# EAGLE design M3_80 (EAGLE 6.2)
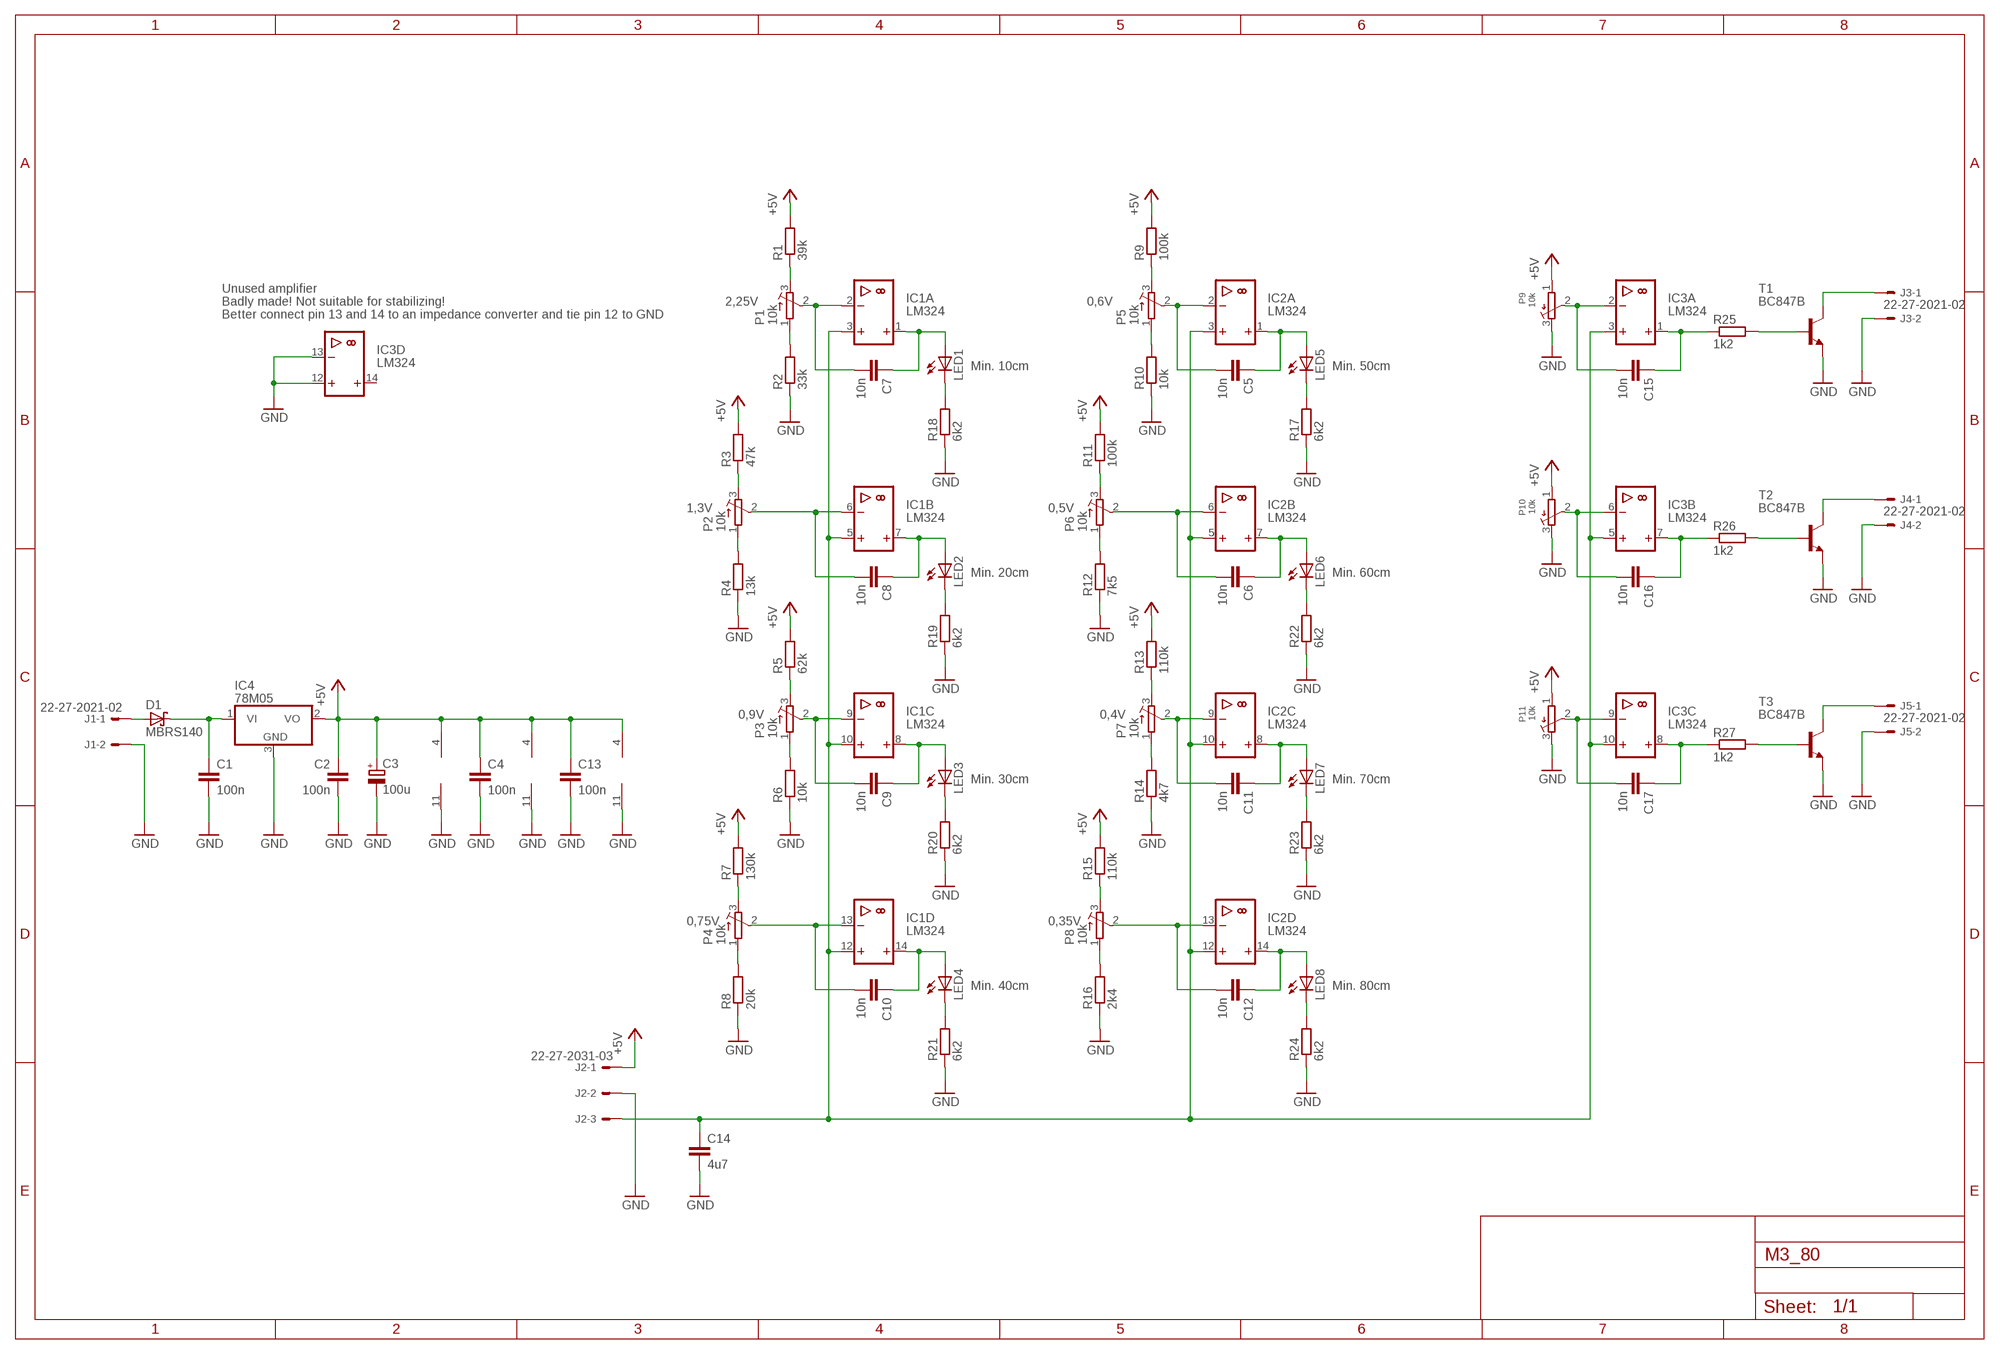
[diagram p0: schematic, sheet 1]

## Parts
C1  100n  C-EUC0805K  [C0805K]
C2  100n  C-EUC0805K  [C0805K]
C3  100u  CPOL-EUD/7343-31W  [D/7343-31W]
C4  100n  C-EUC0805K  [C0805K]
C5  10n  C-EUC0805K  [C0805K]
C6  10n  C-EUC0805K  [C0805K]
C7  10n  C-EUC0805K  [C0805K]
C8  10n  C-EUC0805K  [C0805K]
C9  10n  C-EUC0805K  [C0805K]
C10  10n  C-EUC0805K  [C0805K]
C11  10n  C-EUC0805K  [C0805K]
C12  10n  C-EUC0805K  [C0805K]
C13  100n  C-EUC0805K  [C0805K]
C14  4u7  C-EUC0805K  [C0805K]
C15  10n  C-EUC0805K  [C0805K]
C16  10n  C-EUC0805K  [C0805K]
C17  10n  C-EUC0805K  [C0805K]
D1  MBRS140  MBRS130LT3  [SMB]
IC1  LM324  QUAD-OPAMPD  [SO14]
IC2  LM324  QUAD-OPAMPD  [SO14]
IC3  LM324  QUAD-OPAMPD  [SO14]
IC4  78M05  7805DT  [TO252]
J1  22-27-2021-02  [6410-02]
J2  22-27-2031-03  [6410-03]
J3  22-27-2021-02  [6410-02]
J4  22-27-2021-02  [6410-02]
J5  22-27-2021-02  [6410-02]
LED1  LED3MM  [LED3MM]
LED2  LED3MM  [LED3MM]
LED3  LED3MM  [LED3MM]
LED4  LED3MM  [LED3MM]
LED5  LED3MM  [LED3MM]
LED6  LED3MM  [LED3MM]
LED7  LED3MM  [LED3MM]
LED8  LED3MM  [LED3MM]
P1  10k  EVM1D  [EVM1D]
P2  10k  EVM1D  [EVM1D]
P3  10k  EVM1D  [EVM1D]
P4  10k  EVM1D  [EVM1D]
P5  10k  EVM1D  [EVM1D]
P6  10k  EVM1D  [EVM1D]
P7  10k  EVM1D  [EVM1D]
P8  10k  EVM1D  [EVM1D]
P9  10k  T63YA  [T63YA]
P10  10k  T63YA  [T63YA]
P11  10k  T63YA  [T63YA]
R1  39k  R-EU_M0805  [M0805]
R2  33k  R-EU_M0805  [M0805]
R3  47k  R-EU_M0805  [M0805]
R4  13k  R-EU_M0805  [M0805]
R5  62k  R-EU_M0805  [M0805]
R6  10k  R-EU_M0805  [M0805]
R7  130k  R-EU_M0805  [M0805]
R8  20k  R-EU_M0805  [M0805]
R9  100k  R-EU_M0805  [M0805]
R10  10k  R-EU_M0805  [M0805]
R11  100k  R-EU_M0805  [M0805]
R12  7k5  R-EU_M0805  [M0805]
R13  110k  R-EU_M0805  [M0805]
R14  4k7  R-EU_M0805  [M0805]
R15  110k  R-EU_M0805  [M0805]
R16  2k4  R-EU_M0805  [M0805]
R17  6k2  R-EU_M0805  [M0805]
R18  6k2  R-EU_M0805  [M0805]
R19  6k2  R-EU_M0805  [M0805]
R20  6k2  R-EU_M0805  [M0805]
R21  6k2  R-EU_M0805  [M0805]
R22  6k2  R-EU_M0805  [M0805]
R23  6k2  R-EU_M0805  [M0805]
R24  6k2  R-EU_M0805  [M0805]
R25  1k2  R-EU_M0805  [M0805]
R26  1k2  R-EU_M0805  [M0805]
R27  1k2  R-EU_M0805  [M0805]
T1  BC847B  BC847  [SOT23]
T2  BC847B  BC847  [SOT23]
T3  BC847B  BC847  [SOT23]

## Nets
+5V: C2.1 C3.+ C4.1 C13.1 IC1.4(P:V+) IC2.4(P:V+) IC3.4(P:V+) IC4.2(VO) J2.1 P9.1 P10.1 P11.1 R1.2 R3.2 R5.2 R7.2 R9.2 R11.2 R13.2 R15.2
GND: C1.2 C2.2 C3.- C4.2 C13.2 C14.2 IC1.11(P:V-) IC2.11(P:V-) IC3.11(P:V-) IC3.12(D:+IN) IC3.13(D:-IN) IC4.3(GND) J1.2 J2.2 J3.2 J4.2 J5.2 P9.3 P10.3 P11.3 R2.1 R4.1 R6.1 R8.1 R10.1 R12.1 R14.1 R16.1 R17.1 R18.1 R19.1 R20.1 R21.1 R22.1 R23.1 R24.1 T1.2(E) T2.2(E) T3.2(E)
N$1: C1.1 D1.C IC4.1(VI)
N$2: C7.2 IC1.2(A:-IN) P1.2
N$3: C8.2 IC1.6(B:-IN) P2.2
N$4: C9.2 IC1.9(C:-IN) P3.2
N$5: C10.2 IC1.13(D:-IN) P4.2
N$6: C5.2 IC2.2(A:-IN) P5.2
N$7: C6.2 IC2.6(B:-IN) P6.2
N$8: C11.2 IC2.9(C:-IN) P7.2
N$9: C12.2 IC2.13(D:-IN) P8.2
N$10: C5.1 IC2.1(A:OUT) LED5.A
N$11: LED5.K(C) R17.2
N$12: C8.1 IC1.7(B:OUT) LED2.A
N$13: LED2.K(C) R19.2
N$14: C7.1 IC1.1(A:OUT) LED1.A
N$15: LED1.K(C) R18.2
N$16: C9.1 IC1.8(C:OUT) LED3.A
N$17: LED3.K(C) R20.2
N$18: C10.1 IC1.14(D:OUT) LED4.A
N$19: LED4.K(C) R21.2
N$20: C6.1 IC2.7(B:OUT) LED6.A
N$21: LED6.K(C) R22.2
N$22: C11.1 IC2.8(C:OUT) LED7.A
N$23: LED7.K(C) R23.2
N$24: C12.1 IC2.14(D:OUT) LED8.A
N$25: LED8.K(C) R24.2
N$26: P5.3 R9.1
N$27: P5.1 R10.2
N$28: P6.3 R11.1
N$29: P6.1 R12.2
N$30: P7.3 R13.1
N$31: P7.1 R14.2
N$32: P8.3 R15.1
N$33: P1.3 R1.1
N$34: P8.1 R16.2
N$35: C16.2 IC3.6(B:-IN) P10.2
N$36: C15.2 IC3.2(A:-IN) P9.2
N$37: C17.2 IC3.9(C:-IN) P11.2
N$38: P1.1 R2.2
N$39: D1.A J1.1
N$41: P2.3 R3.1
N$42: P2.1 R4.2
N$43: P3.3 R5.1
N$44: P3.1 R6.2
N$45: P4.3 R7.1
N$46: P4.1 R8.2
N$47: C15.1 IC3.1(A:OUT) R25.1
N$48: R25.2 T1.1(B)
N$49: C16.1 IC3.7(B:OUT) R26.1
N$50: R26.2 T2.1(B)
N$51: C17.1 IC3.8(C:OUT) R27.1
N$52: R27.2 T3.1(B)
N$53: J5.1 T3.3(C)
N$54: J4.1 T2.3(C)
N$55: J3.1 T1.3(C)
N$71: C14.1 IC1.3(A:+IN) IC1.5(B:+IN) IC1.10(C:+IN) IC1.12(D:+IN) IC2.3(A:+IN) IC2.5(B:+IN) IC2.10(C:+IN) IC2.12(D:+IN) IC3.3(A:+IN) IC3.5(B:+IN) IC3.10(C:+IN) J2.3
Unconnected: IC3.14(D:OUT)

## Notes on the sheet
- Unused amplifier
- Badly made! Not suitable for stabilizing! | 2,25V | 0,6V
- Better connect pin 13 and 14 to an impedance converter and tie pin 12 to GND
- Min. 10cm | Min. 50cm
- 1,3V | 0,5V
- Min. 20cm | Min. 60cm
- 0,9V | 0,4V
- Min. 30cm | Min. 70cm
- 0,75V | 0,35V
- Min. 40cm | Min. 80cm

## Library data of the parts
C1 C2 C4-C17 = resistor:C-EU: CAPACITOR, European symbol
C3 = resistor:CPOL-EU: POLARIZED CAPACITOR, European symbol
D1 = diode:MBRS130LT3: Schottky Power Rectifier Source: http://www.onsemi.com/pub/Collateral/MBRS130LT3-D.PDF
IC1-IC3 = OPAMP:QUAD-OPAMP
IC4 = linear:78*: Positive VOLTAGE REGULATOR Source: http://cache.national.com/ds/LM/LM78L05.pdf http://www.fairchildsemi.com/ds/LM/LM7805.pdf
J1 J3-J5 = con-molex:22-?-02: CONNECTOR wire to board 2.54 mm (.1 inch) pitch header; OC_FARNELL: unknown; OC_NEWARK: unknown
J2 = con-molex:22-?-03: CONNECTOR wire to board 2.54 mm (.1 inch) pitch header; OC_FARNELL: unknown; OC_NEWARK: unknown
LED1-LED8 = led:LED: LED OSRAM: - CHIPLED LG R971, LG N971, LY N971, LG Q971, LY Q971, LO R971, LY R971 LH N974, LH R974 LS Q976, LO Q976, LY Q976 LO Q996 - Hyper CHIPLED LW Q18S LB Q993, LB Q99A, LB R99A - SideLED LS A670, LO A670, LY A670, LG A670, LP A670 LB A673, LV A673, LT A673, LW A673 LH A674 LY A675 LS A676, LA A676, LO A676, LY A676, LW A676 LS A679, LY A679, LG A679 - Hyper Micro SIDELED® LS Y876, LA Y876, LO Y876, LY Y876 LT Y87S - SmartLED LW L88C, LW L88S LB L89C, LB L89S, LG L890 LS L89K, LO L89K, LY L89K LS L896, LA L896, LO L896, LY L896 - TOPLED LS T670, LO T670, LY T670, LG T670, LP T670 LSG T670, LSP T670, LSY T670, LOP T670, LYG T670 LG T671, LOG T671, LSG T671 LB T673, LV T673, LT T673, LW T673 LH T674 LS T676, LA T676, LO T676, LY T676, LB T676, LH T676, LSB T676, LW T676 LB T67C, LV T67C, LT T67C, LS T67K, LO T67K, LY T67K, LW E67C LS E67B, LA E67B, LO E67B, LY E67B, LB E67C, LV E67C, LT E67C LW T67C LS T679, LY T679, LG T679 LS T770, LO T770, LY T770, LG T770, LP T770 LB T773, LV T773, LT T773, LW T773 LH T774 LS E675, LA E675, LY E675, LS T675 LS T776, LA T776, LO T776, LY T776, LB T776 LHGB T686 LT T68C, LB T68C - Hyper Mini TOPLED® LB M676 - Mini TOPLED Santana® LG M470 LS M47K, LO M47K, LY M47K Source: http://www.osram.convergy.de LUXEON: - LUMILED® LXK2-PW12-R00, LXK2-PW12-S00, LXK2-PW14-U00, LXK2-PW14-V00 LXK2-PM12-R00, LXK2-PM12-S00, LXK2-PM14-U00 LXK2-PE12-Q00, LXK2-PE12-R00, LXK2-PE12-S00, LXK2-PE14-T00, LXK2-PE14-U00 LXK2-PB12-K00, LXK2-PB12-L00, LXK2-PB12-M00, LXK2-PB14-N00, LXK2-PB14-P00, LXK2-PB14-Q00 LXK2-PR12-L00, LXK2-PR12-M00, LXK2-PR14-Q00, LXK2-PR14-R00 LXK2-PD12-Q00, LXK2-PD12-R00, LXK2-PD12-S00 LXK2-PH12-R00, LXK2-PH12-S00 LXK2-PL12-P00, LXK2-PL12-Q00, LXK2-PL12-R00 Source: www.luxeon.com KINGBRIGHT: KA-3528ASYC Source: www.kingbright.com
P1-P8 = R-Trim_Panasonic:EVM1D
P9-P11 = T63YA Vishay:T63YA
R1-R27 = resistor:R-EU_: RESISTOR, European symbol
T1-T3 = transistor:BC847: NPN TRANSISTOR

## Board
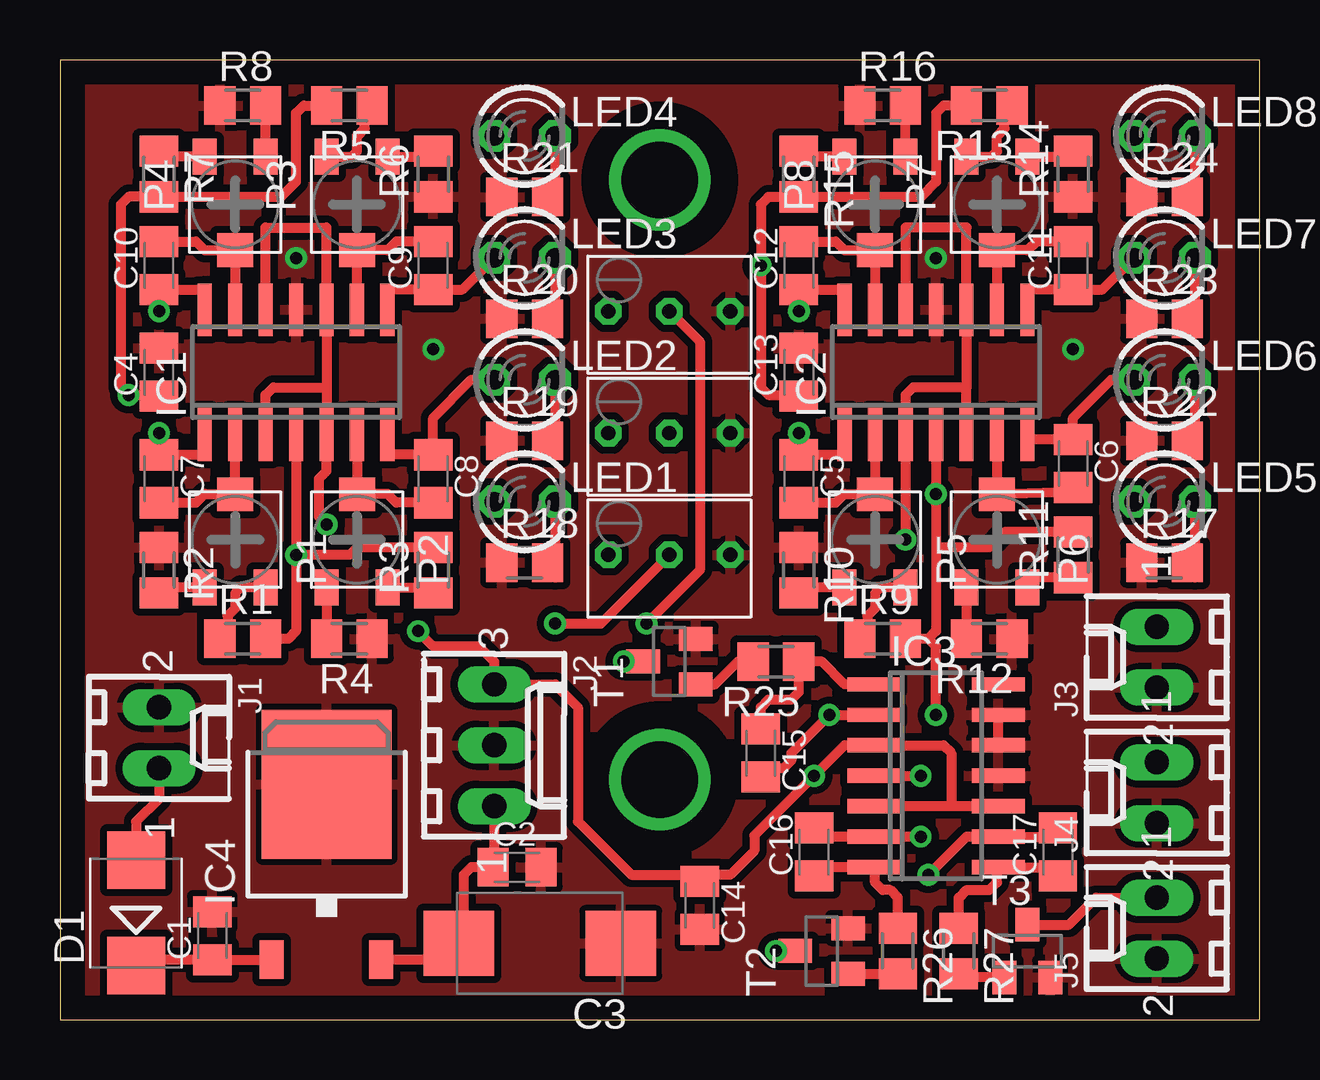
[diagram p1: board, top side]
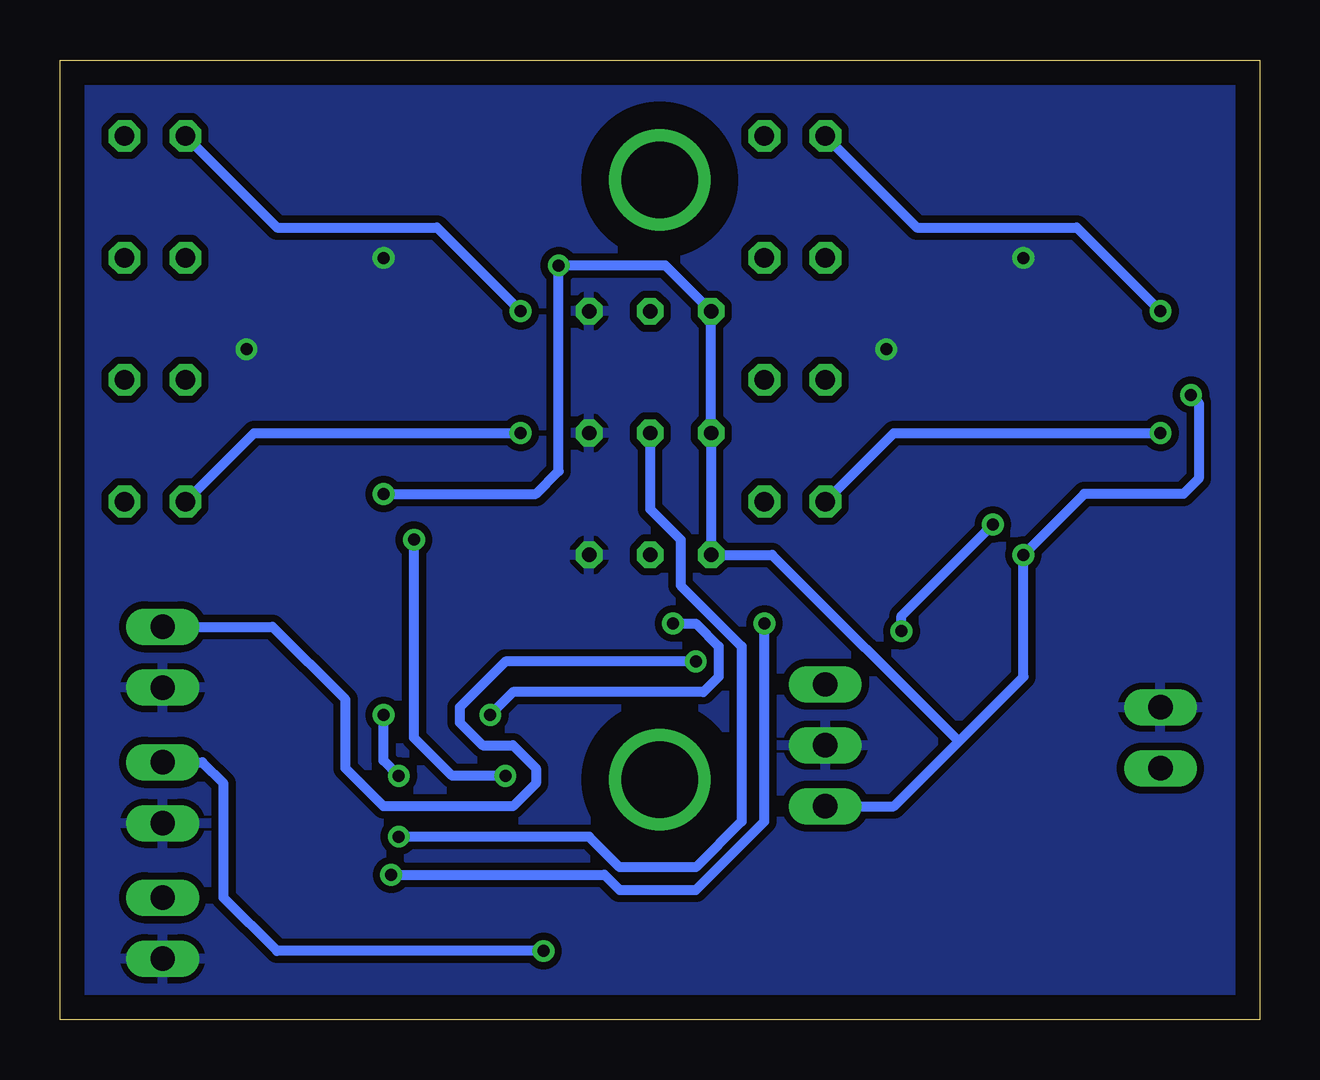
[diagram p2: board, bottom side, seen from below]

Size 50 x 40 mm. Coordinates in mm from the lower left corner, seen from the top.
Outline: 0,0 50,0 50,40 0,40 0,0
Copper layers (1*16): Top 0.035mm / dielectric 1.5mm / Bottom 0.035mm
Design rules: minimum track width 10mil, minimum drill 24mil, track to track 8mil, track to pad 8mil, pad to pad 8mil, via to via 8mil, smd to smd 8mil, copper to edge 40mil, drill to drill 8mil, minimum pad ring 10mil, minimum via ring 8mil, stop-mask expansion 4mil, vias tented up to drill 0mil, thermal gap 10mil
tRestrict: area 22.2,32.2 to 27.8,37.8; area 22.2,7.2 to 27.8,12.8
bRestrict: area 22.2,32.2 to 27.8,37.8; area 22.2,7.2 to 27.8,12.8

### Footprints (pad centres in the part's own frame; a part is rotated, then mirrored left to right if it is on the bottom)
C0805K = smd 1.3 x 1.6: 1 -1,0; 2 1,0
D/7343-31W = smd 2.95 x 2.7: + 3.375,0; - -3.375,0
SMB = smd 2.4 x 2.4: A 2.2,0; C -2.2,0
SO14 = smd 0.6 x 2.2: 1 -3.81,-2.6; 2 -2.54,-2.6; 3 -1.27,-2.6; 4 0,-2.6; 5 1.27,-2.6; 6 2.54,-2.6; 7 3.81,-2.6; 8 3.81,2.6; 9 2.54,2.6; 10 1.27,2.6; 11 0,2.6; 12 -1.27,2.6; 13 -2.54,2.6; 14 -3.81,2.6
TO252 = smd 1 x 1.6: 1 -2.28,-4.8; 2 2.28,-4.8 | smd 5.4 x 6.2: 3 0,2.5
6410-02 = drill 1.016 long: 1 1.27,0; 2 -1.27,0
6410-03 = drill 1.016 long: 1 2.54,0; 2 0,0; 3 -2.54,0
LED3MM = drill 0.813 octagon: A -1.27,0; K 1.27,0
EVM1D = smd 1 x 1.5: 1 -1.275,-2; 3 1.275,-2 | smd 1.5 x 1.4: 2 0,1.9
T63YA = drill 0.6 octagon: 1 0,2.54; 2 0,0; 3 0,-2.54
M0805 = smd 1.3 x 1.6: 1 -0.95,0; 2 0.95,0
SOT23 = smd 1 x 1.4: 1 -0.95,-1.1; 2 0.95,-1.1; 3 0,1.1

### Placement (x,y rotation side)
C1  6.35,3.49 90 top
C2  19.05,6.35 0 top
C3  20,3.17 180 top
C4  4.13,26.99 90 top
C5  30.8,22.54 270 top
C6  42.23,23.18 270 top
C7  4.13,22.54 270 top
C8  15.56,22.54 270 top
C9  15.56,31.43 90 top
C10  4.13,31.43 90 top
C11  42.23,31.43 90 top
C12  30.8,31.43 90 top
C13  30.8,26.99 90 top
C14  26.67,4.76 270 top
C15  29.21,11.11 270 top
C16  31.43,6.99 90 top
C17  41.59,6.99 90 top
D1  3.17,4.45 90 top
IC1  9.84,26.99 0 top
IC2  36.51,26.99 0 top
IC3  36.51,10.16 270 top
IC4  11.11,7.3 0 top
J1  4.13,11.75 270 top
J2  18.1,11.43 270 top
J3  45.72,15.11 90 top
J4  45.72,9.46 90 top
J5  45.72,3.81 90 top
LED1  19.37,21.59 0 top
LED2  19.37,26.67 0 top
LED3  19.37,31.75 0 top
LED4  19.37,36.83 0 top
LED5  46.04,21.59 0 top
LED6  46.04,26.67 0 top
LED7  46.04,31.75 0 top
LED8  46.04,36.83 0 top
P1  7.3,20 0 top
P2  12.38,20 0 top
P3  12.38,33.97 180 top
P4  7.3,33.97 180 top
P5  33.97,20 0 top
P6  39.05,20 0 top
P7  39.05,33.97 180 top
P8  33.97,33.97 180 top
P9  25.4,29.53 90 top
P10  25.4,24.45 90 top
P11  25.4,19.37 90 top
R1  7.62,15.88 0 top
R2  4.13,18.73 270 top
R3  15.56,18.73 90 top
R4  12.06,15.88 180 top
R5  12.06,38.1 180 top
R6  15.56,35.24 90 top
R7  4.13,35.24 270 top
R8  7.62,38.1 0 top
R9  34.29,15.88 0 top
R10  30.8,18.73 270 top
R11  42.23,19.37 90 top
R12  38.73,15.88 180 top
R13  38.73,38.1 180 top
R14  42.23,35.24 90 top
R15  30.8,35.24 270 top
R16  34.29,38.1 0 top
R17  46.04,19.05 0 top
R18  19.37,19.05 0 top
R19  19.37,24.13 0 top
R20  19.37,29.21 0 top
R21  19.37,34.29 0 top
R22  46.04,24.13 0 top
R23  46.04,29.21 0 top
R24  46.04,34.29 0 top
R25  29.84,14.92 180 top
R26  34.92,2.86 270 top
R27  37.47,2.86 270 top
T1  25.4,14.92 90 top
T2  31.75,2.86 90 top
T3  40.32,2.86 0 top

### Tracks (layer width: path | path; a pad name or v marks a point on that pad's centre or on a via)
+5V  (via drill 0.5)
  Top 0.406: IC1.4 v9.84,19.37 | v9.84,19.37 9.84,16.19 9.53,15.88 R1.2 | R3.2 12.38,19.68 12.06,19.37 v9.84,19.37 | R5.2 10.16,38.1 9.84,37.78 9.84,34.92 9.21,34.29 R7.2 2.86,34.29 2.54,33.97 2.54,26.35 v2.86,26.04 4.08,26.04 C4.1 | IC4.2 15.96,2.5 C3.+ 16.83,3.38 16.83,6.03 17.14,6.35 C2.1 18.1,6.4 J2.1 | R13.2 36.83,38.1 36.51,37.78 36.51,34.92 35.88,34.29 R15.2 | R15.2 | 36.51,19.68 v36.51,21.91 IC2.4 | 36.51,19.68 36.51,16.19 36.2,15.88 | 36.2,15.88 R9.2 | R11.2 39.37,20.32 38.73,19.68 36.52,19.68 36.51,19.68 | R15.2 29.53,34.29 29.21,33.97 v29.21,31.43 29.21,26.35 29.53,26.04 30.75,26.04 C13.1 | IC3.4 v35.88,10.16 | v36.51,12.7 36.51,15.56 36.2,15.88
  Bottom 0.406: v2.86,26.04 2.54,25.72 2.54,22.54 3.17,21.91 7.3,21.91 v9.84,19.37 9.84,14.29 12.54,11.59 | J2.1 15.24,8.89 12.54,11.59 | v36.51,21.91 30.16,21.91 29.21,22.86 v29.21,31.43 24.77,31.43 P9.1 P10.1 P11.1 20.32,19.37 12.54,11.59 | v35.88,10.16 36.51,10.79 v36.51,12.7
GND  (via drill 0.5)
  Top 0.406: IC3.12 IC3.13
  other vias: 9.84,31.75 36.51,31.75 42.23,27.94 15.56,27.94
  pour Top (isolate 0.305): 0,0 0,40 50,40 50,0
  pour Bottom (isolate 0.305): 0,0 0,40 50,40 50,0
N$1
  Top 0.406: IC4.1 C1.1 3.42,2.49 D1.C
N$2
  Top 0.406: IC1.2 P1.2 7.21,21.91 6.03,21.91 5.67,21.54 C7.2
N$3
  Top 0.406: IC1.6 P2.2 12.48,21.91 13.65,21.91 14.02,21.54 C8.2
N$4
  Top 0.406: IC1.9 P3.2 12.48,32.07 13.65,32.07 14.02,32.43 C9.2
N$5
  Top 0.406: IC1.13 P4.2 7.21,32.07 6.03,32.07 5.67,32.43 C10.2
N$6
  Top 0.406: IC2.2 P5.2 33.88,21.91 32.7,21.91 32.34,21.54 C5.2
N$7
  Top 0.406: IC2.6 P6.2 42.23,22 C6.2
N$8
  Top 0.406: IC2.9 P7.2 39.15,32.07 40.32,32.07 40.69,32.43 C11.2
N$9
  Top 0.406: IC2.13 P8.2 33.88,32.07 32.7,32.07 32.34,32.43 C12.2
N$10  (via drill 0.5)
  Top 0.406: IC2.1 32.7,23.5 32.66,23.54 C5.1 v30.8,24.45
  Bottom 0.406: LED5.A 41.91,24.45 v30.8,24.45
N$11
  Top 0.406: LED5.K 47.31,18.42 R17.2
N$12
  Top 0.406: IC1.7 13.65,23.5 13.7,23.54 C8.1 15.56,25.08 17.14,26.67 LED2.A
N$13
  Top 0.406: LED2.K 20.64,23.5 R19.2
N$14  (via drill 0.5)
  Top 0.406: IC1.1 6.03,23.5 5.99,23.54 C7.1 v4.13,24.45
  Bottom 0.406: LED1.A 15.24,24.45 v4.13,24.45
N$15
  Top 0.406: LED1.K 20.64,18.42 R18.2
N$16
  Top 0.406: IC1.8 13.65,30.48 13.7,30.43 C9.1 16.78,30.43 LED3.A
N$17
  Top 0.406: LED3.K 20.64,28.58 R20.2
N$18  (via drill 0.5)
  Top 0.406: IC1.14 6.03,30.48 5.99,30.43 C10.1 v4.13,29.53
  Bottom 0.406: LED4.A 14.29,33.02 7.62,33.02 v4.13,29.53
N$19
  Top 0.406: LED4.K 20.64,33.66 R21.2
N$20
  Top 0.406: 40.37,23.54 40.32,23.81 IC2.7 40.32,24.18 C6.1 42.23,25.08 43.81,26.67 LED6.A
N$21
  Top 0.406: LED6.K 47.31,23.5 R22.2
N$22
  Top 0.406: IC2.8 40.32,30.48 40.37,30.43 C11.1 43.45,30.43 LED7.A
N$23
  Top 0.406: LED7.K 47.31,28.58 R23.2
N$24  (via drill 0.5)
  Top 0.406: IC2.14 32.7,30.16 32.43,30.43 C12.1 v30.8,29.53
  Bottom 0.406: LED8.A 40.96,33.02 34.29,33.02 v30.8,29.53
N$25
  Top 0.406: LED8.K 47.31,33.66 R24.2
N$26
  Top 0.406: P5.3 34.2,18 33.97,17.78 33.97,17.14 33.66,16.83 33.66,16.19 R9.1
N$27
  Top 0.406: P5.1 31.02,18 R10.2
N$28
  Top 0.406: R11.1 40.33,18.42 P6.3
N$29
  Top 0.406: P6.1 R12.2
N$30
  Top 0.406: P7.3 38.83,35.97 39.05,36.2 39.05,36.83 39.37,37.15 39.37,37.78 R13.1
N$31
  Top 0.406: P7.1 42.01,35.97 R14.2
N$32
  Top 0.406: P8.3 31.02,35.97 R15.1
N$33
  Top 0.406: P1.3 7.53,18 7.3,17.78 7.3,17.14 6.99,16.83 6.99,15.56 6.67,15.56 R1.1 6.99,15.88
N$34
  Top 0.406: P8.1 R16.2
N$35  (via drill 0.5)
  Top 0.406: v35.88,7.62 IC3.6 31.8,7.62 C16.2
  Bottom 0.406: P10.2 25.4,21.27 24.13,20 24.13,18.1 21.59,15.56 21.59,8.26 23.5,6.35 26.67,6.35 27.94,7.62 v35.88,7.62
N$36  (via drill 0.5)
  Top 0.406: P9.2 26.67,28.26 26.67,18.73 v24.45,16.51 | IC3.2 v32.07,12.7 30.48,11.11 30.48,10.79 30.16,10.48 29.57,10.48 C15.2
  Bottom 0.406: v24.45,16.51 23.5,16.51 22.54,15.56 22.54,14.29 23.18,13.65 31.11,13.65 v32.07,12.7
N$37  (via drill 0.5)
  Top 0.406: v36.2,6.03 37.78,7.62 IC3.9 41.23,7.62 C17.2 | v20.64,16.51 22.54,16.51 P11.2
  Bottom 0.406: v36.2,6.03 27.3,6.03 26.67,5.4 23.5,5.4 20.64,8.26 v20.64,16.51
N$38
  Top 0.406: P1.1 4.35,18 R2.2
N$39
  Top 0.406: J1.1 4.13,9.21 3.17,8.26 D1.A
N$40  (via drill 3.2)
  other vias: 25,35
N$41
  Top 0.406: P2.3 15.34,18 R3.1
N$42
  Top 0.406: P2.1 11.11,15.88 R4.2
N$43
  Top 0.406: P3.3 12.16,35.97 12.38,36.2 12.38,36.83 12.7,37.15 12.7,38.1 R5.1 | R5.1 | R5.1
N$44
  Top 0.406: P3.1 15.34,35.97 R6.2
N$45
  Top 0.406: P4.3 4.35,35.97 R7.1
N$46
  Top 0.406: P4.1 8.58,38.41 R8.2
N$47
  Top 0.406: IC3.1 32.7,13.97 31.75,14.92 R25.1 30.8,13.65 30.48,13.34 29.53,13.34 29.21,13.02 C15.1
N$48
  Top 0.406: T1.1 27.31,13.97 28.26,14.92 R25.2
N$49
  Top 0.406: R26.1 34.92,5.08 34.61,5.4 34.29,5.4 33.97,5.71 33.97,6.29 IC3.7 31.8,6.35 C16.1 31.39,6.35
N$50
  Top 0.406: T2.1 R26.2
N$51
  Top 0.406: R27.1 37.47,5.08 37.78,5.4 38.73,5.4 39.05,5.71 39.05,6.29 IC3.8 41.23,6.35 C17.1
N$52
  Top 0.406: T3.1 37.47,1.76 R27.2
N$53
  Top 0.406: T3.3 42.06,3.96 43.18,5.08 J5.1
N$54  (via drill 0.5)
  Top 0.406: T2.3 v29.84,2.86
  Bottom 0.406: v29.84,2.86 40.96,2.86 43.18,5.08 43.18,9.84 44.06,10.73 J4.1
N$55  (via drill 0.5)
  Top 0.406: T1.3 v23.5,14.92
  Bottom 0.406: v23.5,14.92 31.43,14.92 33.34,13.02 33.34,12.38 32.38,11.43 31.11,11.43 30.16,10.48 30.16,9.84 31.11,8.89 36.51,8.89 38.1,10.48 38.1,13.34 41.14,16.38 J3.1
N$56  (via drill 3.2)
  other vias: 25,10
N$71  (via drill 0.5)
  Top 0.406: IC1.12 8.57,33.02 11.11,33.02 IC1.10 11.11,26.35 | 11.11,26.35 IC1.5 11.11,22.86 10.79,22.54 10.79,20.95 v11.11,20.64 | IC1.3 8.57,26.04 8.89,26.35 11.11,26.35 | IC2.12 35.24,33.02 37.78,33.02 IC2.10 37.78,26.35 | IC2.5 37.78,26.35 | 37.78,26.35 35.56,26.35 35.24,26.04 IC2.3 v35.24,20 | IC3.10 37.15,8.89 | 37.15,8.89 IC3.5 | 37.15,8.89 37.15,11.11 36.83,11.43 IC3.3 32.7,11.43 v31.43,10.16 28.94,7.67 28.94,7.03 27.94,6.03 26.94,6.03 C14.1 26.4,6.03 23.81,6.03 21.59,8.26 21.59,13.02 20.64,13.97 J2.3 18.1,14.92 17.46,15.56 15.56,15.56 v14.92,16.19
  Bottom 0.406: v31.43,10.16 33.66,10.16 35.24,11.75 v35.24,20 | v14.92,16.19 14.92,16.83 v11.11,20.64

### Text on the board
bStop: M3.80
Ansschluss: 40 | 80 | 30 | 70 | 40 | 30 | 80 | 70 | 20 | 60 | Out 1 | 10 | 50 | 10 | 20 | Out 2 | 50 | 60 | Out 3 | C1 | Sig | GND | GND | Vin 9-30V | GND | C2 | 5V | GND | C3 | GND